# EasyEDA schematic Keyboard V2.json
TITLE: Sheet_1; REV: 1.0; Date: 2019-03-07; Sheet: 1/1; Drawn By: Nikola; Company: Your Company
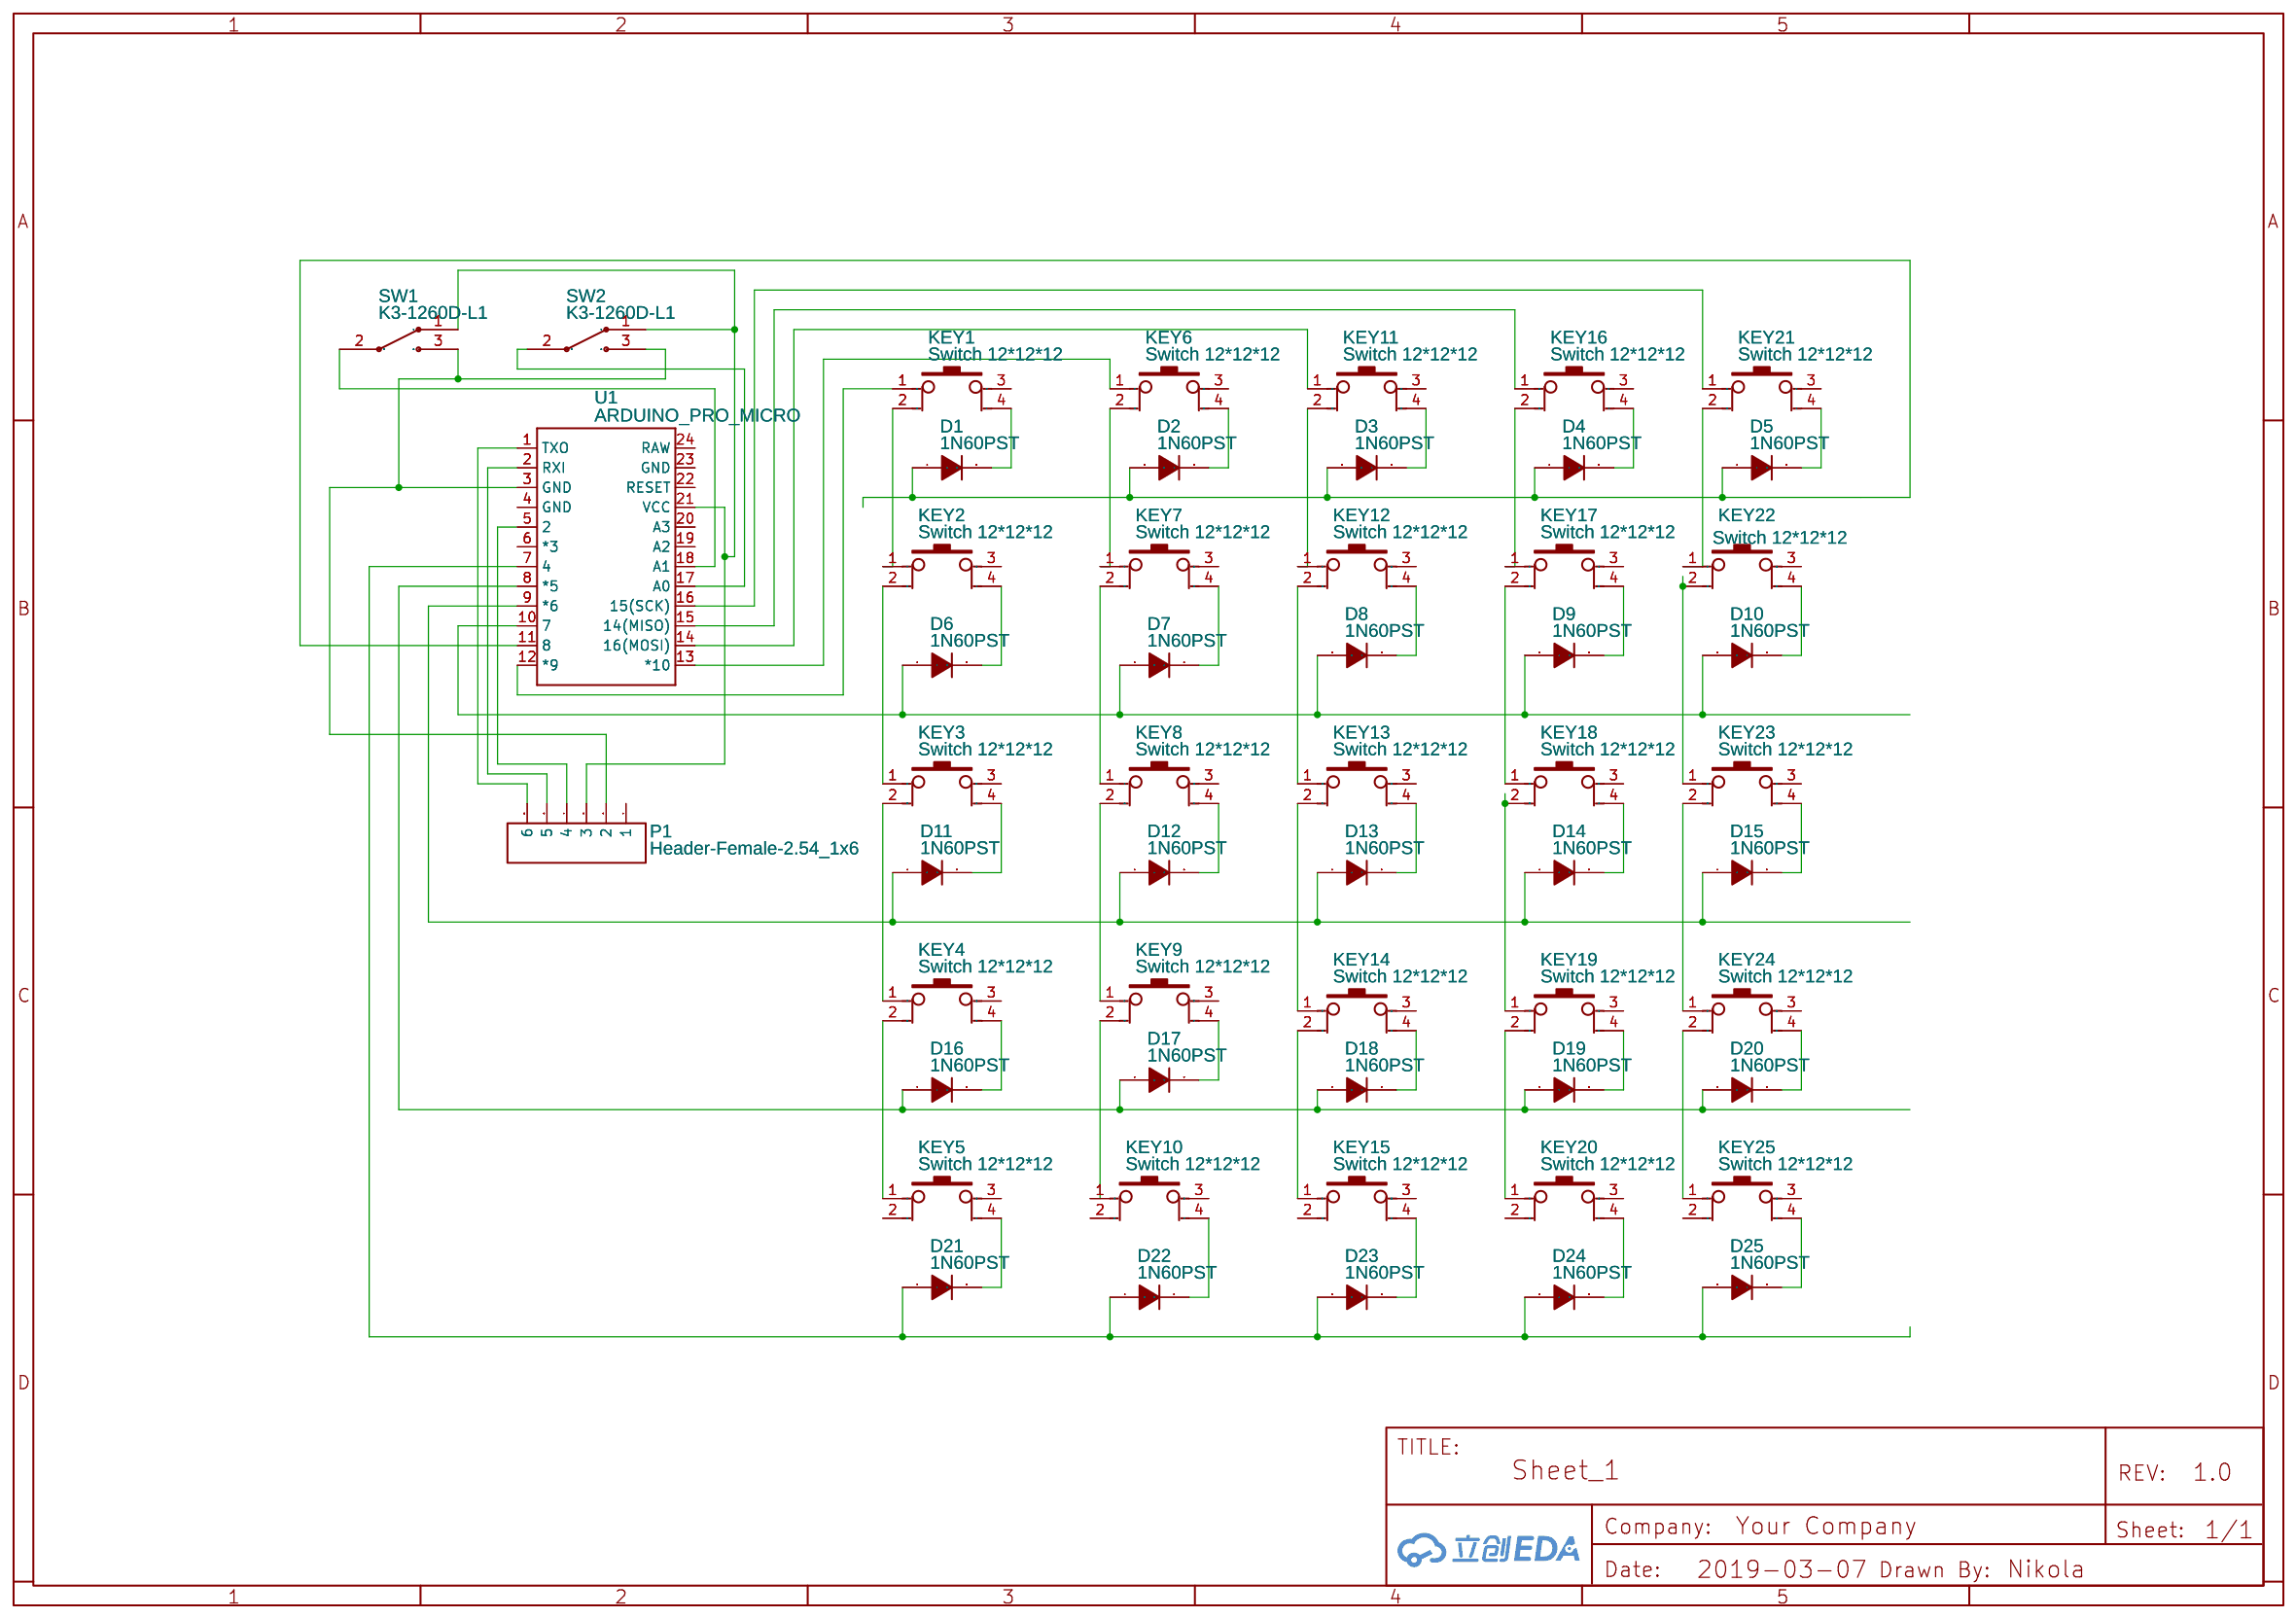
[diagram p0: schematic sheet]

## Parts
D1  1N60PST  [DO-35]
D2  1N60PST  [DO-35]
D3  1N60PST  [DO-35]
D4  1N60PST  [DO-35]
D5  1N60PST  [DO-35]
D6  1N60PST  [DO-35]
D7  1N60PST  [DO-35]
D8  1N60PST  [DO-35]
D9  1N60PST  [DO-35]
D10  1N60PST  [DO-35]
D11  1N60PST  [DO-35]
D12  1N60PST  [DO-35]
D13  1N60PST  [DO-35]
D14  1N60PST  [DO-35]
D15  1N60PST  [DO-35]
D16  1N60PST  [DO-35]
D17  1N60PST  [DO-35]
D18  1N60PST  [DO-35]
D19  1N60PST  [DO-35]
D20  1N60PST  [DO-35]
D21  1N60PST  [DO-35]
D22  1N60PST  [DO-35]
D23  1N60PST  [DO-35]
D24  1N60PST  [DO-35]
D25  1N60PST  [DO-35]
KEY1  Switch 12*12*12  [KEY-12*12]
KEY2  Switch 12*12*12  [KEY-12*12]
KEY3  Switch 12*12*12  [KEY-12*12]
KEY4  Switch 12*12*12  [KEY-12*12]
KEY5  Switch 12*12*12  [KEY-12*12]
KEY6  Switch 12*12*12  [KEY-12*12]
KEY7  Switch 12*12*12  [KEY-12*12]
KEY8  Switch 12*12*12  [KEY-12*12]
KEY9  Switch 12*12*12  [KEY-12*12]
KEY10  Switch 12*12*12  [KEY-12*12]
KEY11  Switch 12*12*12  [KEY-12*12]
KEY12  Switch 12*12*12  [KEY-12*12]
KEY13  Switch 12*12*12  [KEY-12*12]
KEY14  Switch 12*12*12  [KEY-12*12]
KEY15  Switch 12*12*12  [KEY-12*12]
KEY16  Switch 12*12*12  [KEY-12*12]
KEY17  Switch 12*12*12  [KEY-12*12]
KEY18  Switch 12*12*12  [KEY-12*12]
KEY19  Switch 12*12*12  [KEY-12*12]
KEY20  Switch 12*12*12  [KEY-12*12]
KEY21  Switch 12*12*12  [KEY-12*12]
KEY22  Switch 12*12*12  [KEY-12*12]
KEY23  Switch 12*12*12  [KEY-12*12]
KEY24  Switch 12*12*12  [KEY-12*12]
KEY25  Switch 12*12*12  [KEY-12*12]
P1  Header-Female-2.54_1x6  [HDR-6X1/2.54]
SW1  K3-1260D-L1  [K3-1260D-L1]
SW2  K3-1260D-L1  [K3-1260D-L1]
U1  ARDUINO_PRO_MICRO  [ARDUINO_PRO_MICRO]

## Library data of the parts
D1-D25 = -: Supplier: LCSC; Manufacturer: SEMTECH; image: //image.lceda.cn/szlcsc/C41623.jpg; Supplier Part: C41623
KEY1-KEY25 = -: Supplier: LCSC; Manufacturer: ReliaPro; Supplier Part: C14121
P1 = -: Supplier: LCSC; Manufacturer: BOOMELE; Manufacturer Part: Female header 1*6p; Supplier Part: C40877
SW1 SW2 = -: Supplier: LCSC; Manufacturer: HRO; Supplier Part: C92657
U1 = -: Contributor: SparkFun; Manufacturer Part: ?

## Nets
Net-(D1-1): D1.1(A) D2.1(A) D3.1(A) D4.1(A) D5.1(A) U1.11(8)
Net-(D1-2): D1.2(K) KEY1.4
Net-(D2-2): D2.2(K) KEY6.4
Net-(D3-2): D3.2(K) KEY11.4
Net-(D4-2): D4.2(K) KEY16.4
Net-(D5-2): D5.2(K) KEY21.4
Net-(D6-1): D6.1(A) D7.1(A) D8.1(A) D9.1(A) D10.1(A) U1.10(7)
Net-(D6-2): D6.2(K) KEY2.4
Net-(D7-2): D7.2(K) KEY7.4
Net-(D8-2): D8.2(K) KEY12.4
Net-(D9-2): D9.2(K) KEY17.4
Net-(D10-2): D10.2(K) KEY22.4
Net-(D11-1): D11.1(A) D12.1(A) D13.1(A) D14.1(A) D15.1(A) U1.9(*6)
Net-(D11-2): D11.2(K) KEY3.4
Net-(D12-2): D12.2(K) KEY8.4
Net-(D13-2): D13.2(K) KEY13.4
Net-(D14-2): D14.2(K) KEY18.4
Net-(D15-2): D15.2(K) KEY23.4
Net-(D16-1): D16.1(A) D17.1(A) D18.1(A) D19.1(A) D20.1(A) U1.8(*5)
Net-(D16-2): D16.2(K) KEY4.4
Net-(D17-2): D17.2(K) KEY9.4
Net-(D18-2): D18.2(K) KEY14.4
Net-(D19-2): D19.2(K) KEY19.4
Net-(D20-2): D20.2(K) KEY24.4
Net-(D21-1): D21.1(A) D22.1(A) D23.1(A) D24.1(A) D25.1(A) U1.7(4)
Net-(D21-2): D21.2(K) KEY5.4
Net-(D22-2): D22.2(K) KEY10.4
Net-(D23-2): D23.2(K) KEY15.4
Net-(D24-2): D24.2(K) KEY20.4
Net-(D25-2): D25.2(K) KEY25.4
Net-(KEY1-1): KEY1.1 U1.12(*9)
Net-(KEY1-2): KEY1.2 KEY2.1
Net-(KEY2-2): KEY2.2 KEY3.1
Net-(KEY3-2): KEY3.2 KEY4.1
Net-(KEY4-2): KEY4.2 KEY5.1
Net-(KEY6-1): KEY6.1 U1.13(*10)
Net-(KEY6-2): KEY6.2 KEY7.1
Net-(KEY7-2): KEY7.2 KEY8.1
Net-(KEY8-2): KEY8.2 KEY9.1
Net-(KEY9-2): KEY9.2 KEY10.1
Net-(KEY11-1): KEY11.1 U1.14(16(MOSI))
Net-(KEY11-2): KEY11.2 KEY12.1
Net-(KEY12-2): KEY12.2 KEY13.1
Net-(KEY13-2): KEY13.2 KEY14.1
Net-(KEY14-2): KEY14.2 KEY15.1
Net-(KEY16-1): KEY16.1 U1.15(14(MISO))
Net-(KEY16-2): KEY16.2 KEY17.1
Net-(KEY17-2): KEY17.2 KEY18.1
Net-(KEY18-2): KEY18.2 KEY19.1
Net-(KEY19-2): KEY19.2 KEY20.1
Net-(KEY21-1): KEY21.1 U1.16(15(SCK))
Net-(KEY21-2): KEY21.2 KEY22.1
Net-(KEY22-2): KEY22.2 KEY23.1
Net-(KEY23-2): KEY23.2 KEY24.1
Net-(KEY24-2): KEY24.2 KEY25.1
Net-(P1-2): P1.2 SW1.3 SW2.3 U1.3(GND)
Net-(P1-3): P1.3 SW1.1 SW2.1 U1.21(VCC)
Net-(P1-4): P1.4 U1.5(2)
Net-(P1-5): P1.5 U1.2(RXI)
Net-(P1-6): P1.6 U1.1(TXO)
Net-(SW1-2): SW1.2 U1.18(A1)
Net-(SW2-2): SW2.2 U1.17(A0)

Not connected (* = marked no-connect by the designer): KEY1 3; KEY2 3; KEY3 3; KEY4 3; KEY5 2 3; KEY6 3; KEY7 3; KEY8 3; KEY9 3; KEY10 2 3; KEY11 3; KEY12 3; KEY13 3; KEY14 3; KEY15 2 3; KEY16 3; KEY17 3; KEY18 3; KEY19 3; KEY20 2 3; KEY21 3; KEY22 3; KEY23 3; KEY24 3; KEY25 2 3; P1 1; U1 4(GND) 6(*3) 19(A2) 20(A3) 22(RESET) 23(GND) 24(RAW)
